# Altium project Analog_Computer.PrjPcb
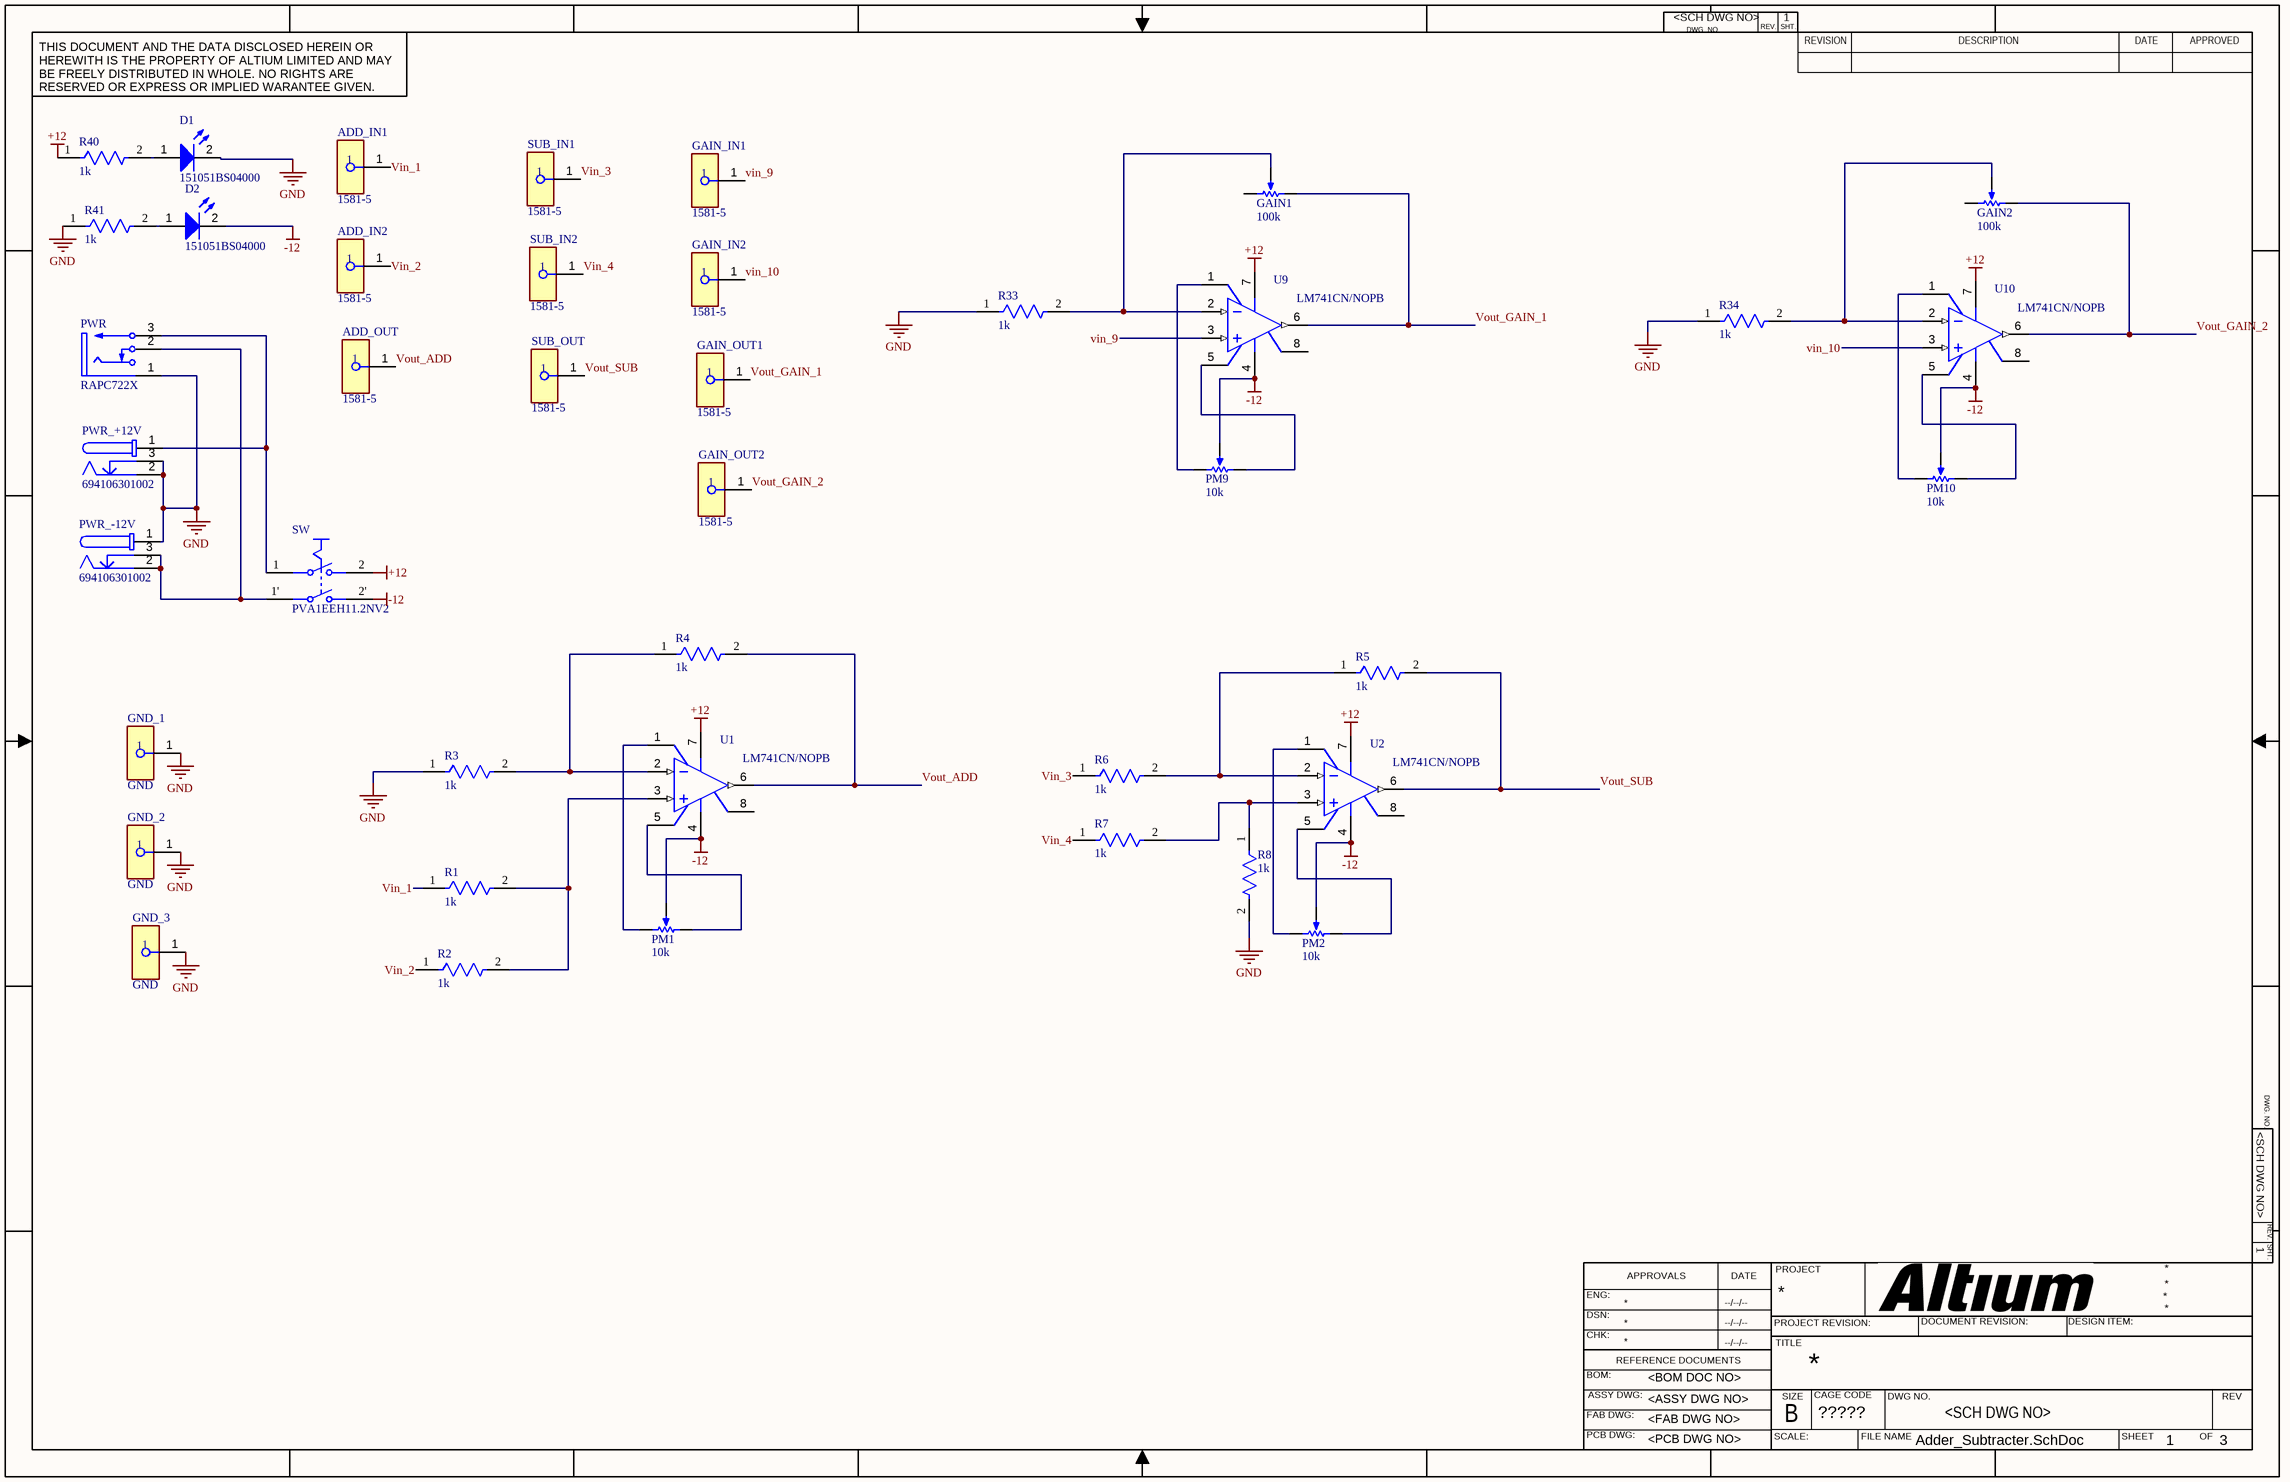
[diagram p0: Adder_Subtracter.SchDoc]
CAGE_CODE: ?????; CONTRACT_NUMBER: <CONTRACT NO>; DOC_NO_ASSY_DWG: <ASSY DWG NO>; DOC_NO_BOM: <BOM DOC NO>; DOC_NO_FAB_DWG: <FAB DWG NO>; DOC_NO_SCH_DWG: <SCH DWG NO>; PCB_2_DEC_TOL: +/-.01; PCB_3_DEC_TOL: +/-.010; PCB_ANG_TOL: +/-1/2; PCB_ASSEMBLY_NO: <PCB ASSY NO>; PCB_CHECKER: - -----; PCB_CHECKER_APP_DATE: --/--/----; PCB_DESIGNER: - -----; PCB_DESIGNER_APP_DATE: --/--/----; PCB_DWG_NO: <PCB DWG NO>; PCB_ENGINEER: - -----; PCB_ENGINEER_APP_DATE: --/--/----; PCB_PART_NUMBER: <PCB PN>; PCB_REV: A; SCH_REV: A
3 sheets, 101 parts. Net scope: global (net labels, ports and power ports of the same name join across sheets).
Board file: PCB1.PcbDoc
Sheets:
  Adder_Subtracter.SchDoc
  Multiplier.SchDoc
  Integrator_Differentiator.SchDoc

## Sheet Adder_Subtracter.SchDoc
size 431 x 279 mm; SheetNumber: 1; SheetTotal: 3; ENG_APP_DATE: --/--/--; DSN_APP_DATE: --/--/--; CHK_APP_DATE: --/--/--

### Parts
ADD_IN1  1581-5  [FP-1581-5-MFG]
ADD_IN2  1581-5  [FP-1581-5-MFG]
ADD_OUT  1581-5  [FP-1581-5-MFG]
D1  151051BS04000  [WL-TMRC_D5.9H8.7]
D2  151051BS04000  [WL-TMRC_D5.9H8.7]
GAIN1  100k  [BOUR-3852A-282-103AL-3_V]
GAIN2  100k  [BOUR-3852A-282-103AL-3_V]
GAIN_IN1  1581-5  [FP-1581-5-MFG]
GAIN_IN2  1581-5  [FP-1581-5-MFG]
GAIN_OUT1  1581-5  [FP-1581-5-MFG]
GAIN_OUT2  1581-5  [FP-1581-5-MFG]
GND_1  GND  [FP-1581-5-MFG]
GND_2  GND  [FP-1581-5-MFG]
GND_3  GND  [FP-1581-5-MFG]
PM1  10k  [BOUR-3362P]
PM2  10k  [BOUR-3362P]
PM9  10k  [BOUR-3362P]
PM10  10k  [BOUR-3362P]
PWR  RAPC722X  [SWITCH-RAPC712X-3_V]
PWR_+12V  694106301002  [694106301002]
PWR_-12V  694106301002  [694106301002]
R1  1k  [FP-RLR07-MFG]
R2  1k  [FP-RLR07-MFG]
R3  1k  [FP-RLR07-MFG]
R4  1k  [FP-RLR07-MFG]
R5  1k  [FP-RLR07-MFG]
R6  1k  [FP-RLR07-MFG]
R7  1k  [FP-RLR07-MFG]
R8  1k  [FP-RLR07-MFG]
R33  1k  [FP-RLR07-MFG]
R34  1k  [FP-RLR07-MFG]
R40  1k  [FP-RLR07-MFG]
R41  1k  [FP-RLR07-MFG]
SUB_IN1  1581-5  [FP-1581-5-MFG]
SUB_IN2  1581-5  [FP-1581-5-MFG]
SUB_OUT  1581-5  [FP-1581-5-MFG]
SW  PVA1EEH11.2NV2  [FP-PVA1EEH11_2NV2-MFG]
U1  LM741CN/NOPB  [P0008A]
U2  LM741CN/NOPB  [P0008A]
U9  LM741CN/NOPB  [P0008A]
U10  LM741CN/NOPB  [P0008A]

### Nets
+12: R40.1 SW.2 U1.7(V+) U2.7(V+) U9.7(V+) U10.7(V+)
-12: D2.2(K) PM1.2(S) PM2.2(S) PM9.2(S) PM10.2(S) SW.2' U1.4(V-) U2.4(V-) U9.4(V-) U10.4(V-)
GND: D1.2(K) GND_1.1 GND_2.1 GND_3.1 PWR.1 PWR_+12V.2 PWR_+12V.3 PWR_-12V.1 R3.1 R8.2 R33.1 R34.1 R41.1
Vin_1: ADD_IN1.1 R1.1
Vin_2: ADD_IN2.1 R2.1
Vin_3: R6.1 SUB_IN1.1
Vin_4: R7.1 SUB_IN2.1
vin_9: GAIN_IN1.1 U9.3(IN+)
vin_10: GAIN_IN2.1 U10.3(IN+)
Vout_ADD: ADD_OUT.1 R4.2 U1.6(OUT)
Vout_GAIN_1: GAIN1.1(CCW) GAIN_OUT1.1 U9.6(OUT)
Vout_GAIN_2: GAIN2.1(CCW) GAIN_OUT2.1 U10.6(OUT)
Vout_SUB: R5.2 SUB_OUT.1 U2.6(OUT)
NetD1_1: D1.1(A) R40.2
NetD2_1: D2.1(A) R41.2
NetGAIN1_2: GAIN1.2(S) R33.2 U9.2(IN-)
NetGAIN2_2: GAIN2.2(S) R34.2 U10.2(IN-)
NetPM1_1: PM1.1(CCW) U1.5(OFS_NULL)
NetPM1_3: PM1.3(CW) U1.1(OFS_NULL)
NetPM2_1: PM2.1(CCW) U2.5(OFS_NULL)
NetPM2_3: PM2.3(CW) U2.1(OFS_NULL)
NetPM9_1: PM9.1(CCW) U9.5(OFS_NULL)
NetPM9_3: PM9.3(CW) U9.1(OFS_NULL)
NetPM10_1: PM10.1(CCW) U10.5(OFS_NULL)
NetPM10_3: PM10.3(CW) U10.1(OFS_NULL)
NetPWR_2: PWR.2 PWR_-12V.2 PWR_-12V.3 SW.1'
NetPWR_3: PWR.3 PWR_+12V.1 SW.1
NetR1_2: R1.2 R2.2 U1.3(IN+)
NetR3_2: R3.2 R4.1 U1.2(IN-)
NetR5_1: R5.1 R6.2 U2.2(IN-)
NetR7_2: R7.2 R8.1 U2.3(IN+)

Not connected (* = marked no-connect by the designer): GAIN1 3(CW); GAIN2 3(CW); U1 8(NC); U2 8(NC); U9 8(NC); U10 8(NC)

### Notes on the sheet
- DWG. NO.
- REV.
- SHT.
- THIS DOCUMENT AND THE DATA DISCLOSED HEREIN OR HEREWITH IS THE PROPERTY OF ALTIUM LIMITED AND MAY BE FREELY DISTRIBUTED IN WHOLE. NO RIGHTS ARE RESERVED OR EXPRESS OR IMPLIED WARANTEE GIVEN.
- REVISION
- DESCRIPTION
- DATE
- APPROVED
- ENG:
- APPROVALS
- PROJECT
- DSN:
- CHK:
- REFERENCE DOCUMENTS
- PROJECT REVISION:
- TITLE
- DOCUMENT REVISION:
- DESIGN ITEM:
- BOM:
- FAB DWG:
- PCB DWG:
- ASSY DWG:
- SCALE:
- SIZE
- B
- CAGE CODE
- FILE NAME
- DWG NO.
- SHEET
- OF
- REV

### Library data of the parts
ADD_IN1 ADD_IN2 ADD_OUT GAIN_IN1 GAIN_IN2 GAIN_OUT1 GAIN_OUT2 GND_1-GND_3 SUB_IN1 SUB_IN2 SUB_OUT = CMP-73906-000011-1: CONN BANANA JACK TURRET GREEN; Body Material: PC; Number of Contacts: 1; Max Current Rating: 15A; Voltage Rating (AC): 30V; Insulation: Mating End Insulated; Voltage Rating: 2.5kV; Voltage Rating (DC): 60V; Gender: Female; Height: 0.25inch; Mount: Panel; RoHS Compliant: Yes; Length: 1.22inch; Orientation: Straight; Diameter: 4.22mm; Lead Free: Lead Free; Package Quantity: 1; Termination: Turret; Current Rating: 15A; Packaging: Bag; Series: 1581; REACH SVHC: No SVHC; Number of Positions: 1; Contact Plating: Tin; Housing Color: Green; Contact Material: Brass; Insulation Material: Polycarbonate; Weight: 0.126lb; Number of Ports: 1; Color: Green; Housing Material: Polycarbonate; Width: 4inch
D1 D2 = CMP-1488-00009-2: NexarPartId: 29717812; Test Current: 20mA; Forward Voltage: 3.2V; Wavelength: 470nm; Lens Size: 5mm; Lens Style: Circular, Diffused, Round; Forward Current: 100mA; Peak Wavelength: 465nm; Viewing Angle: 40°; Luminous Intensity: 500mcd; Max Reverse Voltage (DC): 5V; Color: Blue; Case/Package: Radial; Width: 5mm; Mount: Through Hole; Min Operating Temperature: -40°C; Length: 5mm; Height: 8.6mm; Max Operating Temperature: 85°C; Packaging: Bulk; RoHS: Compliant; REACH SVHC: Unknown; Dominant Wavelength: 470nm
GAIN1 GAIN2 = CMP-2000-05079-1: Diameter Panel Control, 10 KOhm, +/- 10%, 2 W, -1 to 125 degC, 3-Pin THD, RoHS, Bulk; Manufacturer: Bourns; Temperature Coefficient: ±150ppm/degC; Number of Gangs: 1; Other Names: 3852A282103AL; Actuator Length: 0.875"(22.23mm); Resistive Material: Cermet; PCN Design/Specification: PBTResinJun/2011; Rotation: 280deg; PCN Other: MultipleChanges01/Dec/2012; Catalog Drawings: 3852SeriesSide1 / 3852SeriesSide2; Online Catalog: 3852and3856Series; Associated Product: 36-8560-ND / -KNOBINSTRUMW/DIALRND.9"DIA / 36-8555-ND / -KNOBINSTRUMSKIRTEDRND.7"DIA / 36-8556-ND / -KNOBINSTRUMSKIRTEDRND.9"DIA / 36-8565-ND / -KNOBINSTRUMDBLBARRND.7"DIA / 36-8566-ND / -KNOBINSTRUMDBLBARRND.9"DIA / 36-8568-ND / -KNOBINSTRUMSGLBARRND.7"DIA / 36-8569-ND / -KNOBINSTRUMSGLBARRND.9"DIA / 36-8559-ND / -KNOBINSTRUMW/DIALRND.7"DIA / 226-1006-ND / -KNOBBLKGLOSS.75"DIA.250"SHAFT / 226-1007-ND / -KNOBBLKGLOSS.925"DIA.250"SHAFT / 226-1011-ND / -KNOBBLKGLOS; Actuator Diameter: 0.250"(6.35mm); Built in Switch: None; Resistance (Ohms): 10k; Power (Watts): 2W; Actuator Type: Slotted; Standard Package: 45; Tolerance: ±10%; Taper: Linear; Series: 3852; Packaging: Bulk; Category: Potentiometers,VariableResistors; Bushing Thread: 3/8-32; Datasheet URL: https://datasheet.ciiva.com/11831/0900766b80f93b4b-11831016.pdf; Datasheet Version: Sep-14; Number of Turns: 1; Family: RotaryPotentiometers,Rheostats; Termination Style: SolderLug; RoHS Information: 3852A-LMaterialDeclaration; Mounting Type: PanelMount; Manufacturer URL: http://www.bourns.com/
PM1 PM2 PM9 PM10 = CMP-1747-00004-1: Square Trimpot(R) Trimming Potentiometer, 10 KOhm, 300 V, -55 to 125 degC, 3-Pin THD, RoHS, Tube; Voltage Rating: 220 mV; Power Rating: 1 W; Tolerance: 1%; Resistance: 50 mohm; Case/Package: 1206; Length: 3.2 mm; RoHSCompliant: True; PackageDescription: 3-Pin Through Hole Device, Body 6.6 x 6.99 mm, Pitch 2.54 mm; ComponentLink2Description: Datasheet; REACH SVHC: No SVHC; Mount: Surface Mount; Height: 0.6 mm; Packaging: Tape and Reel; ComponentLink1URL: http://www.bourns.com/; Case Code (Imperial): 0612; Pins: 2; Case Code (Metric): 1632; ComponentLink2URL: http://www.bourns.com/docs/Product-Datasheets/3362.pdf; Min Operating Temperature: -25degC; ComponentLink1Description: Manufacturer URL; PackageReference: 3326P; Max Operating Temperature: 125degC; Width: 1.6 mm; Package Quantity: 5000; DatasheetVersion: May-16
PWR = CMP-2000-05384-1: Power Jack, 5 A, 3-Pin THD, RoHS, Bulk; Manufacturer: Switchcraft; Current Rating: 5A; Plug/Mating Plug Diameter: 2.1mmID,5.5mmOD; Gender: Male; Mating Products: S765-ND / -CONNPLUGMINIPWR2CONDWHT/RED / S760K-ND / -CONNPOWERPLUGMINI.08"BLACK / SC1052-ND / -CONNPOWERPLUGMINIBLACK; Number of Positions/Contacts: 2Conductors,2Contacts; Internal Switch(s): SingleSwitch,NormallyClosed; Shielding: Unshielded; Catalog Drawings: RAPC7(1,2)2XSide / RAPC7(1,2)2XTop; Dynamic Catalog: SwitchcraftInc; Other Names: Q2287470A / RAPC722X-ND / SC1313; Standard Package: 2,500; Termination: SolderEyelet(s); Family: Barrel-PowerConnectors; Housing Color: Black; Housing Material: Thermoplastic; RoHS Information: SwitchcraftRoHSInfo; Color: Black; Contact Material - Plating: Nickel; Mounting Type: ThroughHole,RightAngle; Manufacturer URL: http://www.switchcraft.com/; Contact Material: Brass; Datasheet Version: Rev. A, 08/2005; Connector Type: Jack; Category: Connectors,Interconnects; Datasheet URL: http://www.mouser.com/ds/2/393/rapc722x_cd-371352.pdf
PWR_+12V PWR_-12V = CMP-1502-00188-2: NexarPartId: 52676100; Voltage Rating (DC): 20V; Gender: Male; Voltage Rating: 24V; Connector Type: Power; Insulation Resistance: 100MΩ; Current Rating: 5A; Shielding: Unshielded; Number of Contacts: 3; Color: Black; Housing Material: Polyamide; Contact Gender: Female; REACH SVHC: Unknown; Termination: Through Hole; Height: 11mm; RoHS: Compliant; Mount: Through Hole; Flammability Rating: UL94 V-0; Packaging: Bulk; Min Operating Temperature: -40°C; Contact Plating: Tin; Max Operating Temperature: 85°C; Operating Supply Voltage: 24V; Contact Material: Gold, Tin
R1-R8 R33 R34 R40 R41 = CMP-00030-39447724-1: RLR07C1001FSB14 Fixed Resistor, Metal Film, 0.25W, 1000ohm, 250V, 1% +/-Tol, 100ppm/Cel, Through Hole Mount; Wire/Cable Diameter: 50.8µm; Lead Diameter: 640µm; Max Power Dissipation: 250mW; Temperature Coefficient: 100ppm/°C; Resistance: 1kΩ; Lead Length: 38.1mm; Value: 1kΩ; Voltage Rating: 250V; Lead Free: Contains Lead; REACH SVHC: Unknown; Packaging: Bulk; Military Standard: MIL-PRF-39017; Width: 2.29mm; Max Operating Temperature: 150°C; Length: 7.62mm; Min Operating Temperature: -65°C; Composition: Metal Film; Diameter: 2.29mm; Radiation Hardening: No; Features: Military, Moisture Resistant, Weldable; Failure Rate: 0.001%; Case/Package: Conformal; Tolerance: 1%; Voltage Rating (DC): 250V; Schedule B: 8533210090, 8533210090; RoHS: Non-Compliant; Termination: Axial; Power Rating: 250mW; Contact Plating: Lead, Tin; NexarPartId: 39447724; Number of Terminations: 2; Number of Pins: 14
SW = CMP-10035-000009-1: SWITCH PUSH DPST 0.1A 32V; Switch Function: Off-On; Current Rating: 100mA; Electrical Life: 100000Cycles; RoHS Compliant: Yes; Throw Configuration: DPST; Max Operating Temperature: 85°C; Voltage Rating (DC): 32V; Mount: Through Hole; Series: PVA; Min Operating Temperature: -40°C; Termination: PC Pin; Packaging: Bulk
U1 U2 U9 U10 = CMP-0055-00162-3: Operational Amplifier, 8-pin MDIP, Pb-Free; Manufacturer: Texas Instruments; PackageTopMarking: NSUZXYTTE#*LM*741CN; PowerWise: N; CompType: Amplifiers; ComponentLink1Description: Datasheet URL; ComponentLink1URL: http://www.ti.com/general/docs/lit/getliterature.tsp?genericPartNumber=LM741&fileType=pdf; PackageDescription: MDIP, .365 x .250 x .130in, 8 Lead, .100in Pitch; RoHS: Y; PinCount: 8; Code_JEDEC: MS-001-BA; Package Reference: P0008A

## Sheet Multiplier.SchDoc
size 558 x 431 mm; SheetNumber: 2; SheetTotal: 3
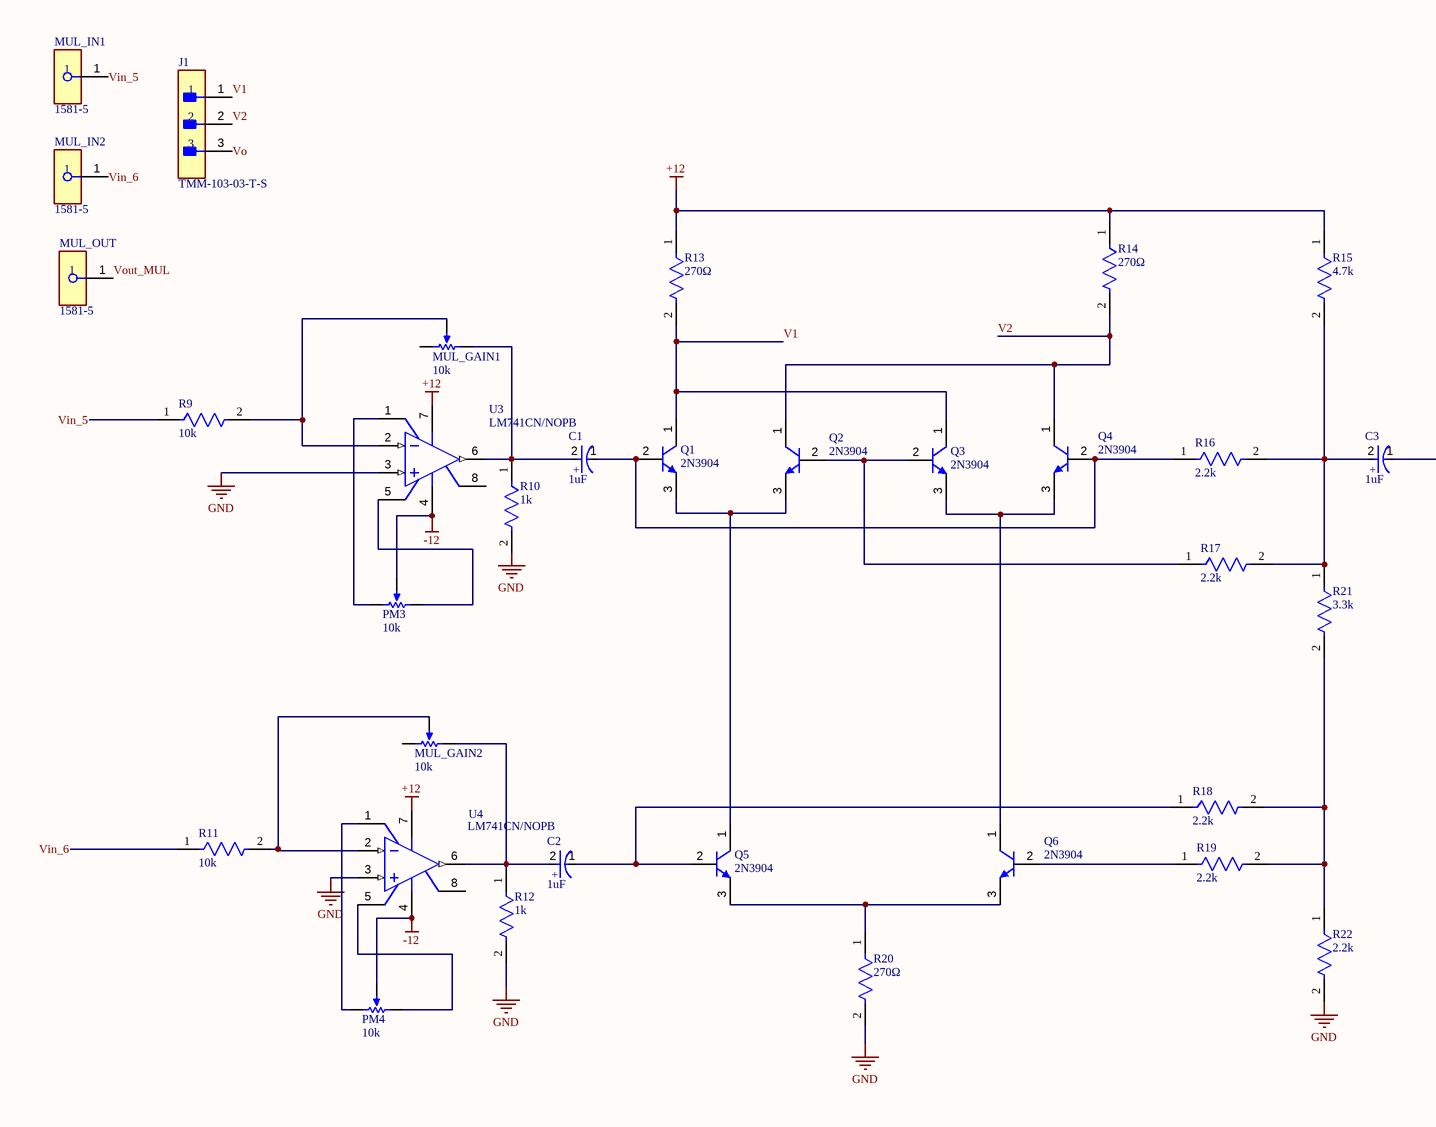
[diagram p1: Multiplier.SchDoc, left]
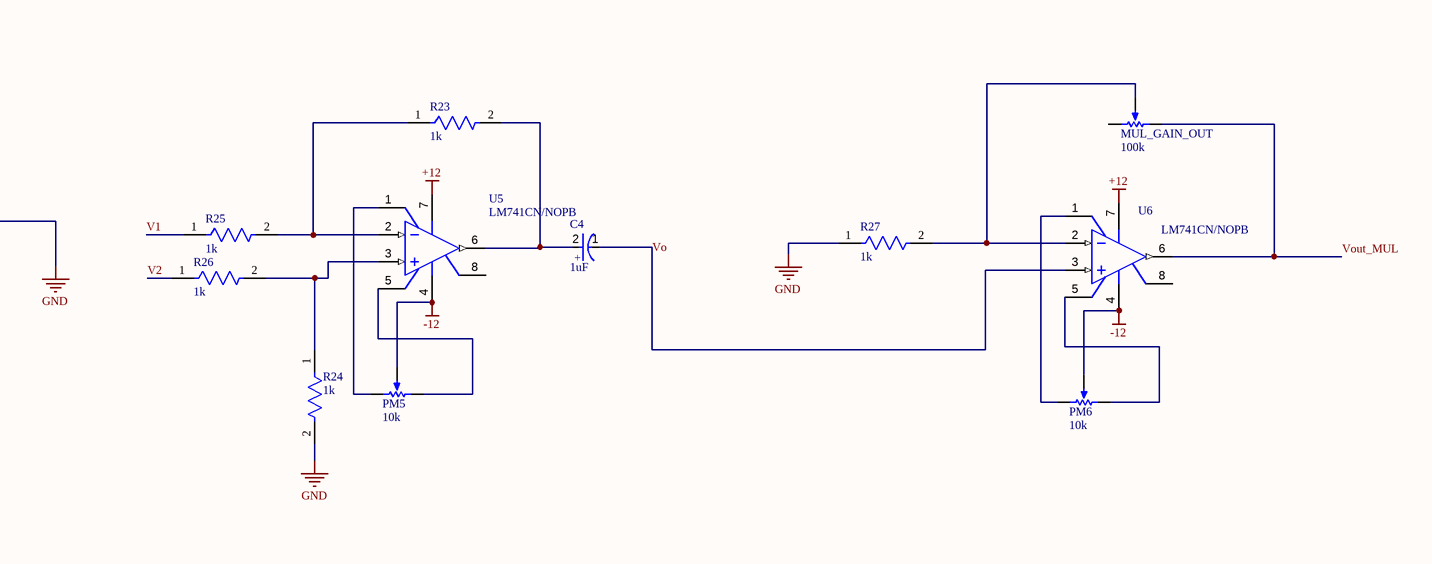
[diagram p2: Multiplier.SchDoc, right]

### Parts
C1  1uF  [FP-ECA-2CHG010I-MFG]
C2  1uF  [FP-ECA-2CHG010I-MFG]
C3  1uF  [FP-ECA-2CHG010I-MFG]
C4  1uF  [FP-ECA-2CHG010I-MFG]
J1  TMM-103-03-T-S  [FP-TMM-103-03-T-S-MFG]
MUL_GAIN1  10k  [BOUR-3852A-282-103AL-3_V]
MUL_GAIN2  10k  [BOUR-3852A-282-103AL-3_V]
MUL_GAIN_OUT  100k  [BOUR-3852A-282-103AL-3_V]
MUL_IN1  1581-5  [FP-1581-5-MFG]
MUL_IN2  1581-5  [FP-1581-5-MFG]
MUL_OUT  1581-5  [FP-1581-5-MFG]
PM3  10k  [BOUR-3362P]
PM4  10k  [BOUR-3362P]
PM5  10k  [BOUR-3362P]
PM6  10k  [BOUR-3362P]
Q1  2N3904  [ONSC-TO-92-3-29-11_AM_BL]
Q2  2N3904  [ONSC-TO-92-3-29-11_AM_BL]
Q3  2N3904  [ONSC-TO-92-3-29-11_AM_BL]
Q4  2N3904  [ONSC-TO-92-3-29-11_AM_BL]
Q5  2N3904  [ONSC-TO-92-3-29-11_AM_BL]
Q6  2N3904  [ONSC-TO-92-3-29-11_AM_BL]
R9  10k  [FP-RLR07-MFG]
R10  1k  [FP-RLR07-MFG]
R11  10k  [FP-RLR07-MFG]
R12  1k  [FP-RLR07-MFG]
R13  270Ω  [FP-RLR07-MFG]
R14  270Ω  [FP-RLR07-MFG]
R15  4.7k  [FP-RLR07-MFG]
R16  2.2k  [FP-RLR07-MFG]
R17  2.2k  [FP-RLR07-MFG]
R18  2.2k  [FP-RLR07-MFG]
R19  2.2k  [FP-RLR07-MFG]
R20  270Ω  [FP-RLR07-MFG]
R21  3.3k  [FP-RLR07-MFG]
R22  2.2k  [FP-RLR07-MFG]
R23  1k  [FP-RLR07-MFG]
R24  1k  [FP-RLR07-MFG]
R25  1k  [FP-RLR07-MFG]
R26  1k  [FP-RLR07-MFG]
R27  1k  [FP-RLR07-MFG]
U3  LM741CN/NOPB  [P0008A]
U4  LM741CN/NOPB  [P0008A]
U5  LM741CN/NOPB  [P0008A]
U6  LM741CN/NOPB  [P0008A]

### Nets
+12: R13.1 R14.1 R15.1 U3.7(V+) U4.7(V+) U5.7(V+) U6.7(V+)
-12: PM3.2(S) PM4.2(S) PM5.2(S) PM6.2(S) U3.4(V-) U4.4(V-) U5.4(V-) U6.4(V-)
GND: C3.1(C) R10.2 R12.2 R20.2 R22.2 R24.2 R27.1 U3.3(IN+) U4.3(IN+)
V1: J1.1 Q1.1(C) Q3.1(C) R13.2 R25.1
V2: J1.2 Q2.1(C) Q4.1(C) R14.2 R26.1
Vin_5: MUL_IN1.1 R9.1
Vin_6: MUL_IN2.1 R11.1
Vo: C4.1(C) J1.3 U6.3(IN+)
Vout_MUL: MUL_GAIN_OUT.1(CCW) MUL_OUT.1 U6.6(OUT)
NetC1_1: C1.1(C) Q1.2(B) Q4.2(B) R16.1
NetC1_2: C1.2(A) MUL_GAIN1.1(CCW) R10.1 U3.6(OUT)
NetC2_1: C2.1(C) Q5.2(B) R18.1
NetC2_2: C2.2(A) MUL_GAIN2.1(CCW) R12.1 U4.6(OUT)
NetC3_2: C3.2(A) R15.2 R16.2 R17.2 R21.1
NetC4_2: C4.2(A) R23.2 U5.6(OUT)
NetMUL_GAIN1_2: MUL_GAIN1.2(S) R9.2 U3.2(IN-)
NetMUL_GAIN2_2: MUL_GAIN2.2(S) R11.2 U4.2(IN-)
NetMUL_GAIN_OUT_2: MUL_GAIN_OUT.2(S) R27.2 U6.2(IN-)
NetPM3_1: PM3.1(CCW) U3.5(OFS_NULL)
NetPM3_3: PM3.3(CW) U3.1(OFS_NULL)
NetPM4_1: PM4.1(CCW) U4.5(OFS_NULL)
NetPM4_3: PM4.3(CW) U4.1(OFS_NULL)
NetPM5_1: PM5.1(CCW) U5.5(OFS_NULL)
NetPM5_3: PM5.3(CW) U5.1(OFS_NULL)
NetPM6_1: PM6.1(CCW) U6.5(OFS_NULL)
NetPM6_3: PM6.3(CW) U6.1(OFS_NULL)
NetQ1_3: Q1.3(E) Q2.3(E) Q5.1(C)
NetQ2_2: Q2.2(B) Q3.2(B) R17.1
NetQ3_3: Q3.3(E) Q4.3(E) Q6.1(C)
NetQ5_3: Q5.3(E) Q6.3(E) R20.1
NetQ6_2: Q6.2(B) R19.1
NetR18_2: R18.2 R19.2 R21.2 R22.1
NetR23_1: R23.1 R25.2 U5.2(IN-)
NetR24_1: R24.1 R26.2 U5.3(IN+)

Not connected (* = marked no-connect by the designer): MUL_GAIN1 3(CW); MUL_GAIN2 3(CW); MUL_GAIN_OUT 3(CW); U3 8(NC); U4 8(NC); U5 8(NC); U6 8(NC)

### Notes on the sheet
- DWG. NO.
- REV.
- SHT.
- REVISION
- DESCRIPTION
- DATE
- APPROVED
- THIS DOCUMENT AND THE DATA DISCLOSED HEREIN OR HEREWITH IS THE PROPERTY OF ALTIUM LIMITED AND MAY BE FREELY DISTRIBUTED IN WHOLE. NO RIGHTS ARE RESERVED OR EXPRESS OR IMPLIED WARANTEE GIVEN.
- ENG:
- DSN:
- APPROVALS
- PROJECT
- DOCUMENT REVISION:
- DESIGN ITEM:
- CHK:
- BOM:
- REFERENCE DOCUMENTS
- PROJECT REVISION:
- TITLE
- FAB DWG:
- PCB DWG:
- ASSY DWG:
- SCALE:
- SIZE
- C
- CAGE CODE
- FILE NAME
- DWG NO.
- SHEET
- OF
- REV
- (in symbol CMP-05427-002176-1) +

### Library data of the parts
C1-C4 = CMP-05427-002176-1: CAP ALUM 1UF 20% 160V RADIAL; Lead/Base Style: Straight; Ripple Current: 17mA; Life (Hours): 2000Hour; Voltage Rating (DC): 160V; Max Operating Temperature: 105°C; Radiation Hardening: No; Min Operating Temperature: -25°C; Packaging: Ammo Pack; Series: NHG; Capacitance: 1uF; Height - Seated (Max): 0.48inch; Lead Pitch: 2.5mm; Diameter: 6.3mm; Length: 11.2mm; Package Quantity: 2000; Termination: Radial; RoHS Compliant: Yes; Voltage Rating: 160V; Tolerance: 20%; Height: 11.2mm; Case/Package: Radial; Mount: Through Hole
J1 = CMP-02766-001695-1: CONN HEADER VERT 3POS 2MM; Gender: Male; Number of Positions: 3; Max Current Rating: 3.9A; Max Voltage Rating (AC): 500V; Packaging: Bulk; RoHS Compliant: Yes; Mount: Through Hole; Length: 6mm; Contact Type: Male Pin; Package Quantity: 1; Depth: 1.97mm; Contact Material: Bronze; Insulation Material: Polymer; Series: TMM; Contact Plating: Tin; Fastening Type: Pull; Housing Color: Black; Pitch: 2mm; Termination: Solder; Contact Mating Length: 0.157inch; Min Operating Temperature: -55°C; REACH SVHC: No SVHC; Orientation: Straight; Number of Rows: 1; Color: Black; Insulation Color: Black; Connector Type: Header; Radiation Hardening: No; Number of Contacts: 3; Lead Free: Lead Free; Contact Finish - Mating: TIN; Max Operating Temperature: 105°C; Housing Material: Polymer; Contact Shape: Square
MUL_GAIN1 MUL_GAIN2 = CMP-2000-05079-1: Diameter Panel Control, 10 KOhm, +/- 10%, 2 W, -1 to 125 degC, 3-Pin THD, RoHS, Bulk; Manufacturer: Bourns; Temperature Coefficient: ±150ppm/degC; Number of Gangs: 1; Other Names: 3852A282103AL; Actuator Length: 0.875"(22.23mm); Resistive Material: Cermet; PCN Design/Specification: PBTResinJun/2011; Rotation: 280deg; PCN Other: MultipleChanges01/Dec/2012; Catalog Drawings: 3852SeriesSide1 / 3852SeriesSide2; Online Catalog: 3852and3856Series; Associated Product: 36-8560-ND / -KNOBINSTRUMW/DIALRND.9"DIA / 36-8555-ND / -KNOBINSTRUMSKIRTEDRND.7"DIA / 36-8556-ND / -KNOBINSTRUMSKIRTEDRND.9"DIA / 36-8565-ND / -KNOBINSTRUMDBLBARRND.7"DIA / 36-8566-ND / -KNOBINSTRUMDBLBARRND.9"DIA / 36-8568-ND / -KNOBINSTRUMSGLBARRND.7"DIA / 36-8569-ND / -KNOBINSTRUMSGLBARRND.9"DIA / 36-8559-ND / -KNOBINSTRUMW/DIALRND.7"DIA / 226-1006-ND / -KNOBBLKGLOSS.75"DIA.250"SHAFT / 226-1007-ND / -KNOBBLKGLOSS.925"DIA.250"SHAFT / 226-1011-ND / -KNOBBLKGLOS; Actuator Diameter: 0.250"(6.35mm); Built in Switch: None; Power (Watts): 2W; Actuator Type: Slotted; Standard Package: 45; Tolerance: ±10%; Taper: Linear; Series: 3852; Packaging: Bulk; Category: Potentiometers,VariableResistors; Bushing Thread: 3/8-32; Datasheet URL: https://datasheet.ciiva.com/11831/0900766b80f93b4b-11831016.pdf; Datasheet Version: Sep-14; Number of Turns: 1; Family: RotaryPotentiometers,Rheostats; Termination Style: SolderLug; Resistance (Ohms): 10k; RoHS Information: 3852A-LMaterialDeclaration; Mounting Type: PanelMount; Manufacturer URL: http://www.bourns.com/
MUL_GAIN_OUT = CMP-2000-05079-1: as GAIN1 on sheet Adder_Subtracter; Standard Package: 45; Tolerance: ±10%; Taper: Linear; Series: 3852; Packaging: Bulk; Category: Potentiometers,VariableResistors; Bushing Thread: 3/8-32; Datasheet URL: https://datasheet.ciiva.com/11831/0900766b80f93b4b-11831016.pdf; Datasheet Version: Sep-14; Number of Turns: 1; Family: RotaryPotentiometers,Rheostats; Termination Style: SolderLug; RoHS Information: 3852A-LMaterialDeclaration; Mounting Type: PanelMount; Manufacturer URL: http://www.bourns.com/
MUL_IN1 MUL_IN2 MUL_OUT = CMP-73906-000011-1: as ADD_IN1 on sheet Adder_Subtracter; Height: 0.25inch; Mount: Panel; RoHS Compliant: Yes; Length: 1.22inch; Orientation: Straight; Diameter: 4.22mm; Lead Free: Lead Free; Package Quantity: 1; Termination: Turret; Current Rating: 15A; Packaging: Bag; Series: 1581; REACH SVHC: No SVHC; Number of Positions: 1; Contact Plating: Tin; Housing Color: Green; Contact Material: Brass; Insulation Material: Polycarbonate; Weight: 0.126lb; Number of Ports: 1; Color: Green; Housing Material: Polycarbonate; Width: 4inch
PM3-PM6 = CMP-1747-00004-1: as PM1 on sheet Adder_Subtracter; Case/Package: 1206; Length: 3.2 mm; RoHSCompliant: True; PackageDescription: 3-Pin Through Hole Device, Body 6.6 x 6.99 mm, Pitch 2.54 mm; ComponentLink2Description: Datasheet; REACH SVHC: No SVHC; Mount: Surface Mount; Height: 0.6 mm; Packaging: Tape and Reel; ComponentLink1URL: http://www.bourns.com/; Case Code (Imperial): 0612; Pins: 2; Case Code (Metric): 1632; ComponentLink2URL: http://www.bourns.com/docs/Product-Datasheets/3362.pdf; Min Operating Temperature: -25degC; ComponentLink1Description: Manufacturer URL; PackageReference: 3326P; Max Operating Temperature: 125degC; Width: 1.6 mm; Package Quantity: 5000; DatasheetVersion: May-16
Q1-Q6 = CMP-1048-01603-1: Amplifier Transistor, NPN Silicon, 3-Pin TO-92, Pb-Free, Tape and Reel - BC548BRL1G; Manufacturer: On Semiconductor; fT Min (MHz): 150; IC Continuous (A): 0.1; ComponentLink3Description: Package Specification; ComponentLink1Description: Manufacturer URL; Packing: Tape and Reel; ComponentLink1URL: http://www.onsemi.com/; PackageReference: TO-92-3-29-11_AM_BL; Polarity: NPN; ComponentLink3URL: http://www.onsemi.com/pub_link/Collateral/MAC97-D.PDF; DatasheetVersion: Rev. 7; PackageDescription: 3-Pin Transistor Outline, Body 4.825 x 3.685 mm, Pitch 1.27 mm; ComponentLink2Description: Datasheet; PartNumber: BC548BRL1G; Mounting Technology: Through Hole; PackageVersion: Rev. AM; RoHS: TRUE; ComponentLink2URL: http://www.onsemi.com/pub_link/Collateral/BC546-D.PDF
R9-R27 = CMP-00030-39447724-1: as R1 on sheet Adder_Subtracter; Voltage Rating: 250V; Lead Free: Contains Lead; REACH SVHC: Unknown; Packaging: Bulk; Military Standard: MIL-PRF-39017; Width: 2.29mm; Max Operating Temperature: 150°C; Length: 7.62mm; Min Operating Temperature: -65°C; Composition: Metal Film; Diameter: 2.29mm; Radiation Hardening: No; Features: Military, Moisture Resistant, Weldable; Failure Rate: 0.001%; Case/Package: Conformal; Tolerance: 1%; Voltage Rating (DC): 250V; Schedule B: 8533210090, 8533210090; RoHS: Non-Compliant; Termination: Axial; Power Rating: 250mW; Contact Plating: Lead, Tin; NexarPartId: 39447724; Number of Terminations: 2; Number of Pins: 14
U3-U6 = CMP-0055-00162-3: as U1 on sheet Adder_Subtracter; ComponentLink1Description: Datasheet URL; ComponentLink1URL: http://www.ti.com/general/docs/lit/getliterature.tsp?genericPartNumber=LM741&fileType=pdf; PackageDescription: MDIP, .365 x .250 x .130in, 8 Lead, .100in Pitch; RoHS: Y; PinCount: 8; Code_JEDEC: MS-001-BA; Package Reference: P0008A

## Sheet Integrator_Differentiator.SchDoc
size 431 x 279 mm; SheetNumber: 3; SheetTotal: 3
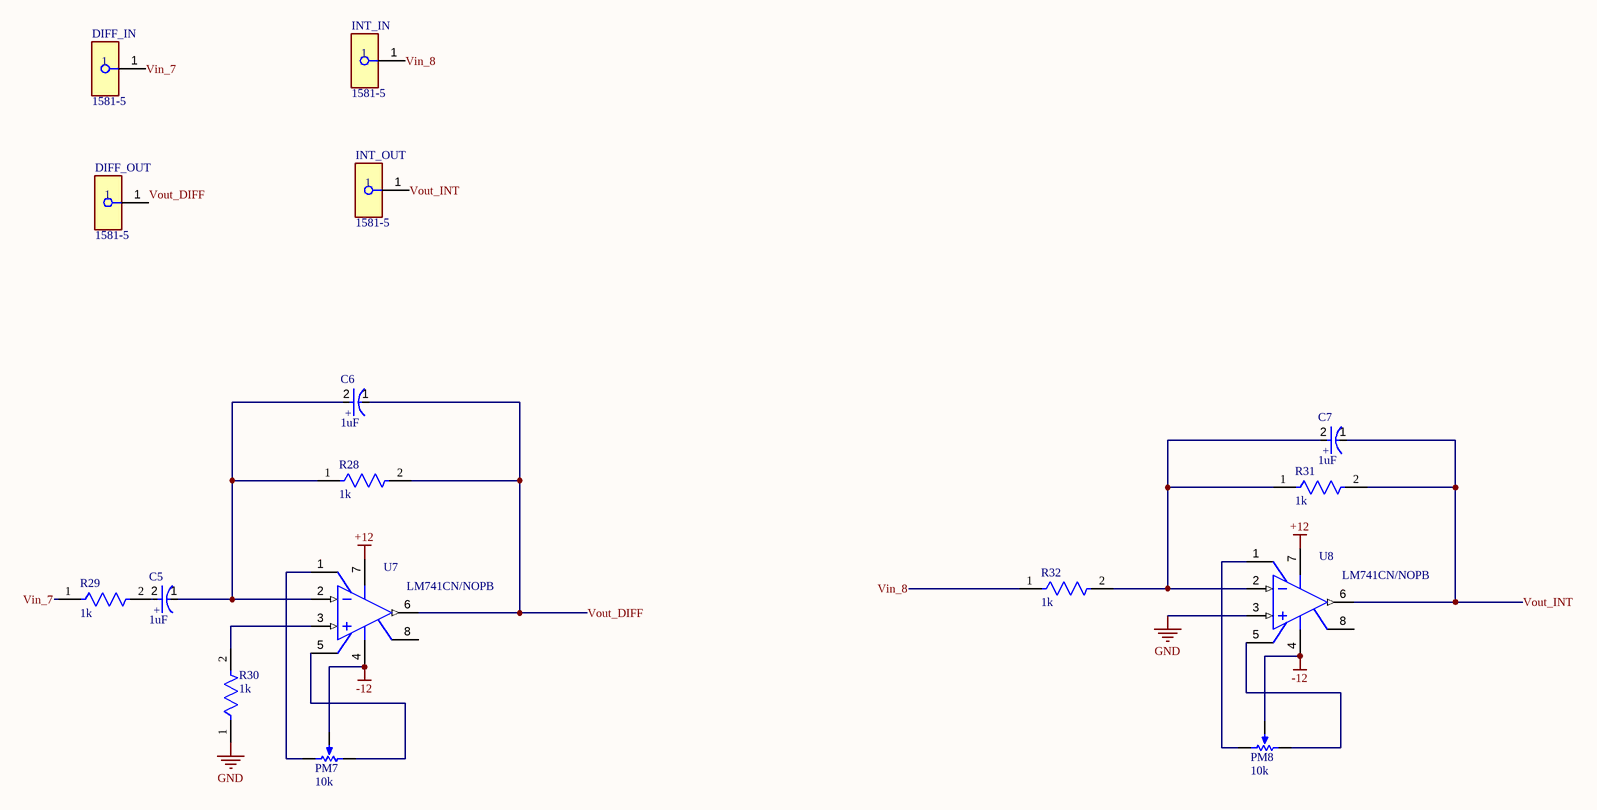
[diagram p3: Integrator_Differentiator.SchDoc]

### Parts
C5  1uF  [FP-ECA-2CHG010I-MFG]
C6  1uF  [FP-ECA-2CHG010I-MFG]
C7  1uF  [FP-ECA-2CHG010I-MFG]
DIFF_IN  1581-5  [FP-1581-5-MFG]
DIFF_OUT  1581-5  [FP-1581-5-MFG]
INT_IN  1581-5  [FP-1581-5-MFG]
INT_OUT  1581-5  [FP-1581-5-MFG]
PM7  10k  [BOUR-3362P]
PM8  10k  [BOUR-3362P]
R28  1k  [FP-RLR07-MFG]
R29  1k  [FP-RLR07-MFG]
R30  1k  [FP-RLR07-MFG]
R31  1k  [FP-RLR07-MFG]
R32  1k  [FP-RLR07-MFG]
U7  LM741CN/NOPB  [P0008A]
U8  LM741CN/NOPB  [P0008A]

### Nets
+12: U7.7(V+) U8.7(V+)
-12: PM7.2(S) PM8.2(S) U7.4(V-) U8.4(V-)
GND: R30.1 U8.3(IN+)
Vin_7: DIFF_IN.1 R29.1
Vin_8: INT_IN.1 R32.1
Vout_DIFF: C6.1(C) DIFF_OUT.1 R28.2 U7.6(OUT)
Vout_INT: C7.1(C) INT_OUT.1 R31.2 U8.6(OUT)
NetC5_1: C5.1(C) C6.2(A) R28.1 U7.2(IN-)
NetC5_2: C5.2(A) R29.2
NetC7_2: C7.2(A) R31.1 R32.2 U8.2(IN-)
NetPM7_1: PM7.1(CCW) U7.5(OFS_NULL)
NetPM7_3: PM7.3(CW) U7.1(OFS_NULL)
NetPM8_1: PM8.1(CCW) U8.5(OFS_NULL)
NetPM8_3: PM8.3(CW) U8.1(OFS_NULL)
NetR30_2: R30.2 U7.3(IN+)

Not connected (* = marked no-connect by the designer): U7 8(NC); U8 8(NC)

### Notes on the sheet
- DWG. NO.
- REV.
- SHT.
- THIS DOCUMENT AND THE DATA DISCLOSED HEREIN OR HEREWITH IS THE PROPERTY OF ALTIUM LIMITED AND MAY BE FREELY DISTRIBUTED IN WHOLE. NO RIGHTS ARE RESERVED OR EXPRESS OR IMPLIED WARANTEE GIVEN.
- REVISION
- DESCRIPTION
- DATE
- APPROVED
- ENG:
- APPROVALS
- PROJECT
- DSN:
- CHK:
- REFERENCE DOCUMENTS
- PROJECT REVISION:
- TITLE
- DOCUMENT REVISION:
- DESIGN ITEM:
- BOM:
- FAB DWG:
- PCB DWG:
- ASSY DWG:
- SCALE:
- SIZE
- B
- CAGE CODE
- FILE NAME
- DWG NO.
- SHEET
- OF
- REV
- (in symbol CMP-05427-002176-1) +

### Library data of the parts
C5-C7 = CMP-05427-002176-1: as C1 on sheet Multiplier; Voltage Rating (DC): 160V; Max Operating Temperature: 105°C; Radiation Hardening: No; Min Operating Temperature: -25°C; Packaging: Ammo Pack; Series: NHG; Capacitance: 1uF; Height - Seated (Max): 0.48inch; Lead Pitch: 2.5mm; Diameter: 6.3mm; Length: 11.2mm; Package Quantity: 2000; Termination: Radial; RoHS Compliant: Yes; Voltage Rating: 160V; Tolerance: 20%; Height: 11.2mm; Case/Package: Radial; Mount: Through Hole
DIFF_IN DIFF_OUT INT_IN INT_OUT = CMP-73906-000011-1: as ADD_IN1 on sheet Adder_Subtracter; Height: 0.25inch; Mount: Panel; RoHS Compliant: Yes; Length: 1.22inch; Orientation: Straight; Diameter: 4.22mm; Lead Free: Lead Free; Package Quantity: 1; Termination: Turret; Current Rating: 15A; Packaging: Bag; Series: 1581; REACH SVHC: No SVHC; Number of Positions: 1; Contact Plating: Tin; Housing Color: Green; Contact Material: Brass; Insulation Material: Polycarbonate; Weight: 0.126lb; Number of Ports: 1; Color: Green; Housing Material: Polycarbonate; Width: 4inch
PM7 PM8 = CMP-1747-00004-1: as PM1 on sheet Adder_Subtracter; Case/Package: 1206; Length: 3.2 mm; RoHSCompliant: True; PackageDescription: 3-Pin Through Hole Device, Body 6.6 x 6.99 mm, Pitch 2.54 mm; ComponentLink2Description: Datasheet; REACH SVHC: No SVHC; Mount: Surface Mount; Height: 0.6 mm; Packaging: Tape and Reel; ComponentLink1URL: http://www.bourns.com/; Case Code (Imperial): 0612; Pins: 2; Case Code (Metric): 1632; ComponentLink2URL: http://www.bourns.com/docs/Product-Datasheets/3362.pdf; Min Operating Temperature: -25degC; ComponentLink1Description: Manufacturer URL; PackageReference: 3326P; Max Operating Temperature: 125degC; Width: 1.6 mm; Package Quantity: 5000; DatasheetVersion: May-16
R28-R32 = CMP-00030-39447724-1: as R1 on sheet Adder_Subtracter; Voltage Rating: 250V; Lead Free: Contains Lead; REACH SVHC: Unknown; Packaging: Bulk; Military Standard: MIL-PRF-39017; Width: 2.29mm; Max Operating Temperature: 150°C; Length: 7.62mm; Min Operating Temperature: -65°C; Composition: Metal Film; Diameter: 2.29mm; Radiation Hardening: No; Features: Military, Moisture Resistant, Weldable; Failure Rate: 0.001%; Case/Package: Conformal; Tolerance: 1%; Voltage Rating (DC): 250V; Schedule B: 8533210090, 8533210090; RoHS: Non-Compliant; Termination: Axial; Power Rating: 250mW; Contact Plating: Lead, Tin; NexarPartId: 39447724; Number of Terminations: 2; Number of Pins: 14
U7 U8 = CMP-0055-00162-3: as U1 on sheet Adder_Subtracter; ComponentLink1Description: Datasheet URL; ComponentLink1URL: http://www.ti.com/general/docs/lit/getliterature.tsp?genericPartNumber=LM741&fileType=pdf; PackageDescription: MDIP, .365 x .250 x .130in, 8 Lead, .100in Pitch; RoHS: Y; PinCount: 8; Code_JEDEC: MS-001-BA; Package Reference: P0008A

## Nets that join several sheets
+12: Adder_Subtracter (6 pins), Multiplier (7 pins), Integrator_Differentiator (U7.7 U8.7)
-12: Adder_Subtracter (10 pins), Multiplier (8 pins), Integrator_Differentiator (PM7.2 PM8.2 U7.4 U8.4)
GND: Adder_Subtracter (13 pins), Multiplier (9 pins), Integrator_Differentiator (R30.1 U8.3)